# Altium schematic sheet mcu_sys_sch.SchDoc
size A4
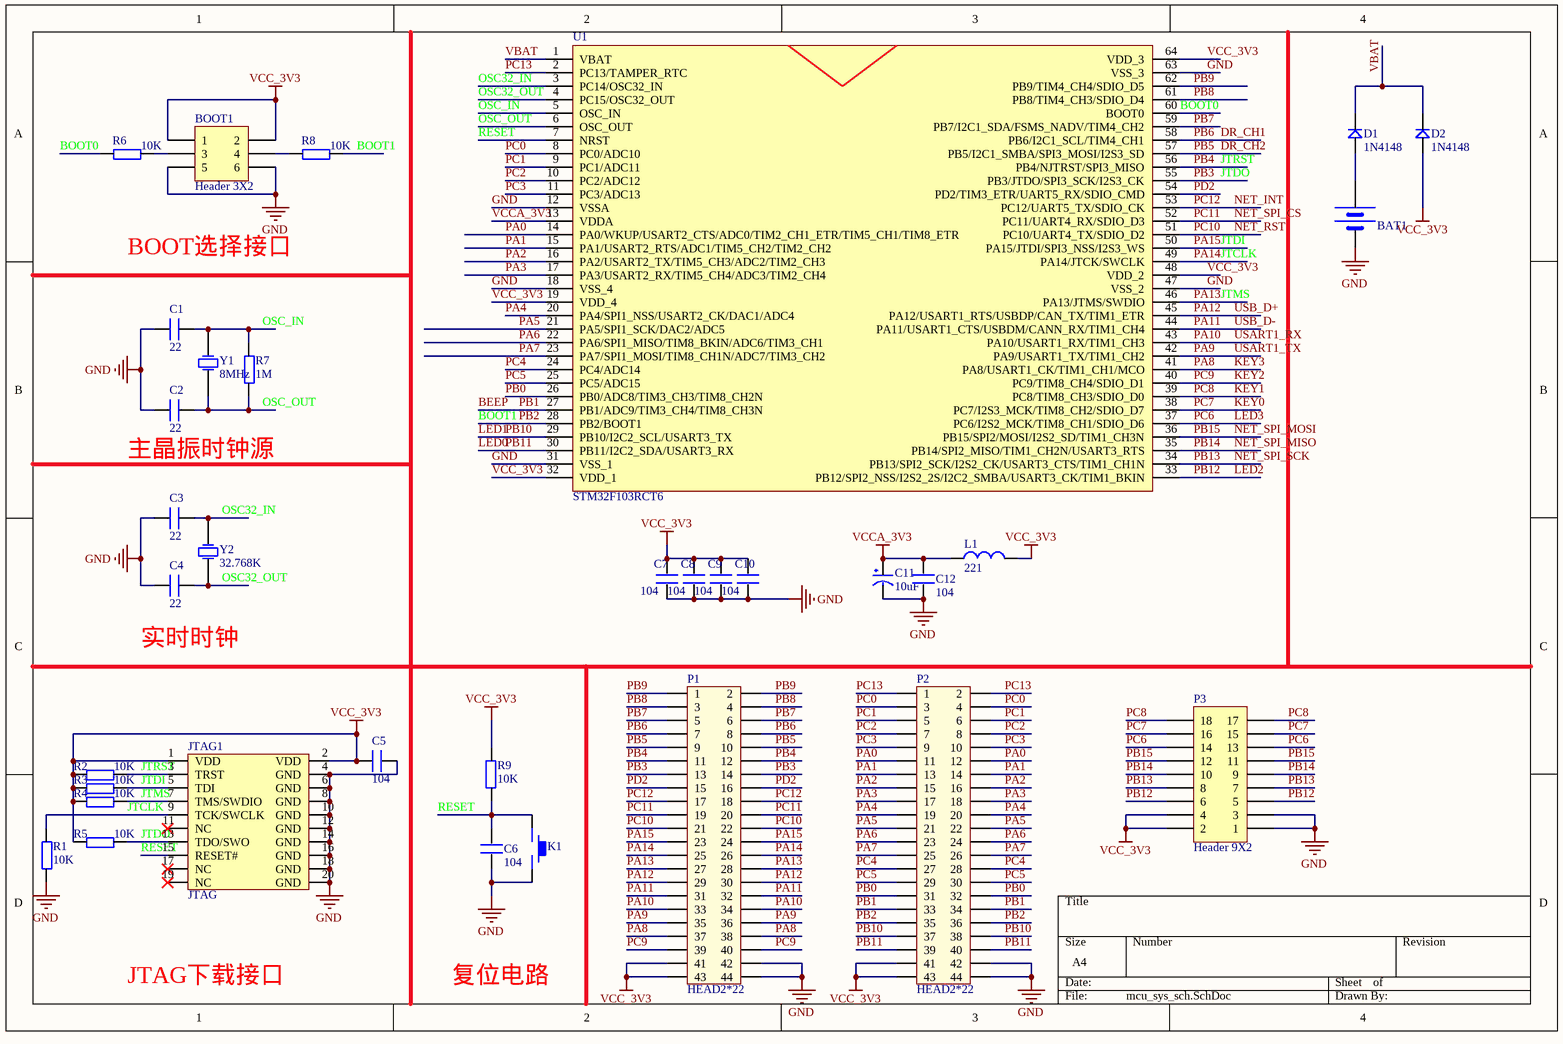
[diagram p0: mcu_sys_sch.SchDoc]

## Parts
BAT1  BATT  [BATM]  (value not drawn)
BOOT1  Header 3X2  [HDR2X3]
C1  22  [0603P]
C2  22  [0603P]
C3  22  [0603P]
C4  22  [0603P]
C5  104  [0603P]
C6  104  [0603P]
C7  104  [0603P]
C8  104  [0603P]
C9  104  [0603P]
C10  104  [0603P]
C11  10uF  [TAJ_A]
C12  104  [0603P]
D1  1N4148  [DIODE_SOP]
D2  1N4148  [DIODE_SOP]
JTAG1  JTAG  [JTAG_20]
K1  KEY  [KEY2]  (value not drawn)
L1  221  [0603P]
P1  HEAD2*22  [HEAD2*22]
P2  HEAD2*22  [HEAD2*22]
P3  Header 9X2  [HDR2X9]
R1  10K  [0603P]
R2  10K  [0603P]
R3  10K  [0603P]
R4  10K  [0603P]
R5  10K  [0603P]
R6  10K  [0603P]
R7  1M  [0603P]
R8  10K  [0603P]
R9  10K  [0603P]
U1  STM32F103RCT6  [STM-LQFP64_N]
Y1  8MHz  [X-SM49]
Y2  32.768K  [XTAL32]

## Nets
GND: BAT1.2(GND) BOOT1.5 BOOT1.6 C1.1 C2.1 C3.1 C4.1 C5.2 C6.1 C7.1 C8.1 C9.1 C10.1 C11.2(GND) C12.1 JTAG1.4(GND) JTAG1.6(GND) JTAG1.8(GND) JTAG1.10(GND) JTAG1.12(GND) JTAG1.14(GND) JTAG1.16(GND) JTAG1.18(GND) JTAG1.20(GND) K1.1 P1.42 P1.44 P2.42 P2.44 P3.1 P3.3 R1.1 U1.12(VSSA) U1.18(VSS_4) U1.31(VSS_1) U1.47(VSS_2) U1.63(VSS_3)
VCC_3V3: BOOT1.1 BOOT1.2 C5.1 C7.2 C8.2 C9.2 C10.2 D2.1 JTAG1.1(VDD) JTAG1.2(VDD) L1.2 P1.41 P1.43 P2.41 P2.43 P3.2 P3.4 R2.1 R3.1 R4.1 R5.1 R9.2 U1.19(VDD_4) U1.32(VDD_1) U1.48(VDD_2) U1.64(VDD_3)
VCCA_3V3: C11.1(VCC) C12.2 L1.1 U1.13(VDDA)
BEEP: P2.33 P2.34 U1.27(PB1/ADC9/TIM3_CH4/TIM8_CH3N)  [also labelled PB1]
BOOT0: R6.1 U1.60(BOOT0)
BOOT1: P2.35 P2.36 R8.2 U1.28(PB2/BOOT1)  [also labelled PB2]
DR_CH1: P1.7 P1.8 U1.58(PB6/I2C1_SCL/TIM4_CH1)  [also labelled PB6]
DR_CH2: P1.9 P1.10 U1.57(PB5/I2C1_SMBA/SPI3_MOSI/I2S3_SD)  [also labelled PB5]
JTCLK: JTAG1.9(TCK/SWCLK) P1.25 P1.26 R1.2 U1.49(PA14/JTCK/SWCLK)  [also labelled PA14]
JTDI: JTAG1.5(TDI) P1.23 P1.24 R3.2 U1.50(PA15/JTDI/SPI3_NSS/I2S3_WS)  [also labelled PA15]
JTDO: JTAG1.13(TDO/SWO) P1.13 P1.14 R5.2 U1.55(PB3/JTDO/SPI3_SCK/I2S3_CK)  [also labelled PB3]
JTMS: JTAG1.7(TMS/SWDIO) P1.27 P1.28 R4.2 U1.46(PA13/JTMS/SWDIO)  [also labelled PA13]
JTRST: JTAG1.3(TRST) P1.11 P1.12 R2.2 U1.56(PB4/NJTRST/SPI3_MISO)  [also labelled PB4]
KEY0: P3.15 P3.16 U1.38(PC7/I2S3_MCK/TIM8_CH2/SDIO_D7)  [also labelled PC7]
KEY1: P3.17 P3.18 U1.39(PC8/TIM8_CH3/SDIO_D0)  [also labelled PC8]
KEY2: P1.39 P1.40 U1.40(PC9/TIM8_CH4/SDIO_D1)  [also labelled PC9]
KEY3: P1.37 P1.38 U1.41(PA8/USART1_CK/TIM1_CH1/MCO)  [also labelled PA8]
LED0: P2.39 P2.40 U1.30(PB11/I2C2_SDA/USART3_RX)  [also labelled PB11]
LED1: P2.37 P2.38 U1.29(PB10/I2C2_SCL/USART3_TX)  [also labelled PB10]
LED2: P3.5 P3.6 U1.33(PB12/SPI2_NSS/I2S2_2S/I2C2_SMBA/USART3_CK/TIM1_BKIN)  [also labelled PB12]
LED3: P3.13 P3.14 U1.37(PC6/I2S2_MCK/TIM8_CH1/SDIO_D6)  [also labelled PC6]
NET_INT: P1.17 P1.18 U1.53(PC12/UART5_TX/SDIO_CK)  [also labelled PC12]
NET_RST: P1.21 P1.22 U1.51(PC10/UART4_TX/SDIO_D2)  [also labelled PC10]
NET_SPI_CS: P1.19 P1.20 U1.52(PC11/UART4_RX/SDIO_D3)  [also labelled PC11]
NET_SPI_MISO: P3.9 P3.10 U1.35(PB14/SPI2_MISO/TIM1_CH2N/USART3_RTS)  [also labelled PB14]
NET_SPI_MOSI: P3.11 P3.12 U1.36(PB15/SPI2/MOSI/I2S2_SD/TIM1_CH3N)  [also labelled PB15]
NET_SPI_SCK: P3.7 P3.8 U1.34(PB13/SPI2_SCK/I2S2_CK/USART3_CTS/TIM1_CH1N)  [also labelled PB13]
OSC32_IN: C3.2 U1.3(PC14/OSC32_IN) Y2.2(OSC2)
OSC32_OUT: C4.2 U1.4(PC15/OSC32_OUT) Y2.1(OSC1)
OSC_IN: C1.2 R7.2 U1.5(OSC_IN) Y1.2(OSC2)
OSC_OUT: C2.2 R7.1 U1.6(OSC_OUT) Y1.1(OSC1)
PA0: P2.11 P2.12 U1.14(PA0/WKUP/USART2_CTS/ADC0/TIM2_CH1_ETR/TIM5_CH1/TIM8_ETR)
PA1: P2.13 P2.14 U1.15(PA1/USART2_RTS/ADC1/TIM5_CH2/TIM2_CH2)
PA2: P2.15 P2.16 U1.16(PA2/USART2_TX/TIM5_CH3/ADC2/TIM2_CH3)
PA3: P2.17 P2.18 U1.17(PA3/USART2_RX/TIM5_CH4/ADC3/TIM2_CH4)
PA4: P2.19 P2.20 U1.20(PA4/SPI1_NSS/USART2_CK/DAC1/ADC4)
PA5: P2.21 P2.22 U1.21(PA5/SPI1_SCK/DAC2/ADC5)
PA6: P2.23 P2.24 U1.22(PA6/SPI1_MISO/TIM8_BKIN/ADC6/TIM3_CH1)
PA7: P2.25 P2.26 U1.23(PA7/SPI1_MOSI/TIM8_CH1N/ADC7/TIM3_CH2)
PA9: P1.35 P1.36 U1.42(PA9/USART1_TX/TIM1_CH2)  [also labelled USART1_TX]
PA10: P1.33 P1.34 U1.43(PA10/USART1_RX/TIM1_CH3)  [also labelled USART1_RX]
PA11: P1.31 P1.32 U1.44(PA11/USART1_CTS/USBDM/CANN_RX/TIM1_CH4)  [also labelled USB_D-]
PA12: P1.29 P1.30 U1.45(PA12/USART1_RTS/USBDP/CAN_TX/TIM1_ETR)  [also labelled USB_D+]
PB0: P2.31 P2.32 U1.26(PB0/ADC8/TIM3_CH3/TIM8_CH2N)
PB7: P1.5 P1.6 U1.59(PB7/I2C1_SDA/FSMS_NADV/TIM4_CH2)
PB8: P1.3 P1.4 U1.61(PB8/TIM4_CH3/SDIO_D4)
PB9: P1.1 P1.2 U1.62(PB9/TIM4_CH4/SDIO_D5)
PC0: P2.3 P2.4 U1.8(PC0/ADC10)
PC1: P2.5 P2.6 U1.9(PC1/ADC11)
PC2: P2.7 P2.8 U1.10(PC2/ADC12)
PC3: P2.9 P2.10 U1.11(PC3/ADC13)
PC4: P2.27 P2.28 U1.24(PC4/ADC14)
PC5: P2.29 P2.30 U1.25(PC5/ADC15)
PC13: P2.1 P2.2 U1.2(PC13/TAMPER_RTC)
PD2: P1.15 P1.16 U1.54(PD2/TIM3_ETR/UART5_RX/SDIO_CMD)
RESET: C6.2 JTAG1.15(RESET#) K1.2 R9.1 U1.7(NRST)
VBAT: D1.2 D2.2 U1.1(VBAT)
NetBAT1_1: BAT1.1(VCC) D1.1
NetBOOT1_3: BOOT1.3 R6.2
NetBOOT1_4: BOOT1.4 R8.1

Not connected (* = marked no-connect by the designer): JTAG1 11(NC)* 17(NC)* 19(NC)*

## Notes on the sheet
- BOOT选择接口
- (near C2) 主晶振时钟源
- (near C4) 实时时钟
- JTAG下载接口
- 复位电路

## Library data of the parts
BAT1 = BAT
BOOT1 = Header 3X2: Header, 3-Pin, Dual row; LatestRevisionDate: 17-Jul-2002; LatestRevisionNote: Re-released for DXP Platform.; Publisher: Altium Limited
C1-C10 C12 = C
C11 = CAP
D1 D2 = D
L1 = Inductor: Value: 221
P3 = Header 9X2: Header, 9-Pin, Dual row; LatestRevisionDate: 17-Jul-2002; LatestRevisionNote: Re-released for DXP Platform.; Publisher: Altium Limited
R1-R9 = R
Y1 Y2 = XTAL: Crystal Oscillator; Published: 8-Jun-2000; LatestRevisionDate: 17-Jul-2002; LatestRevisionNote: Re-released for DXP Platform.; Publisher: Altium Limited